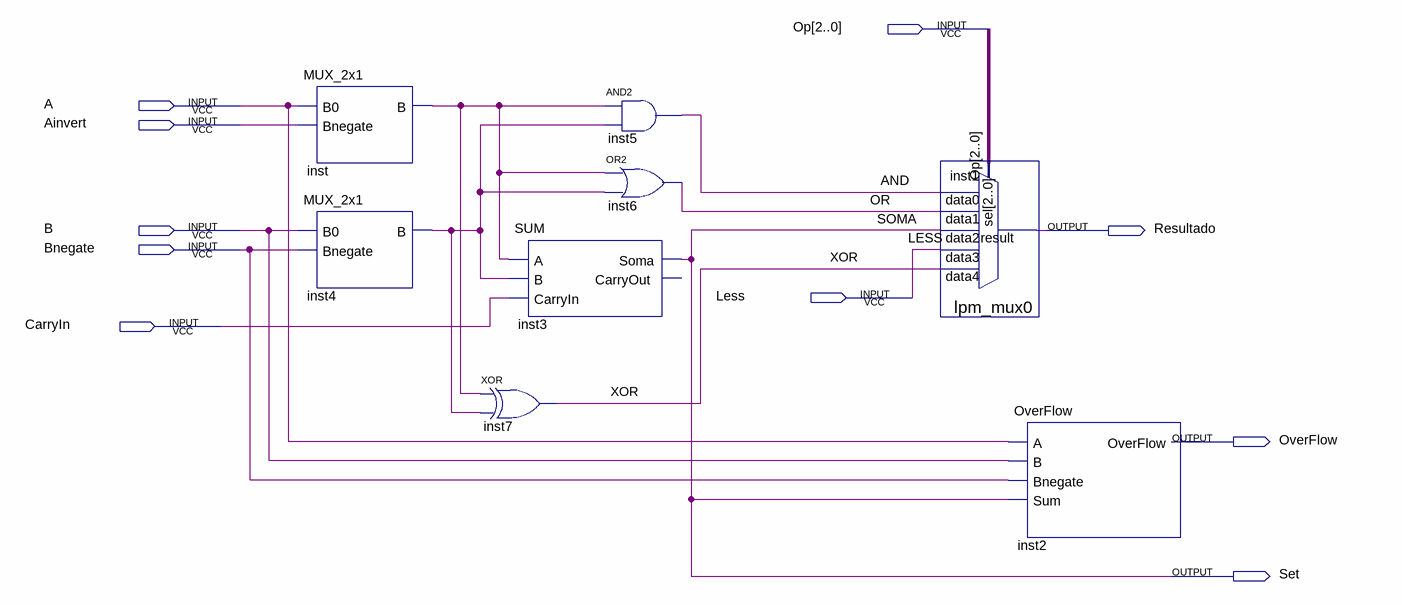
[diagram p0: schematic sheet]
// Quartus schematic MSBALU.bdf as structural Verilog: 8 symbols, 10 pins
module MSBALU (
  input  [2:0] Op,
  input  A,
  input  Ainvert,
  input  B,
  input  Bnegate,
  input  Less,
  input  CarryIn,
  output Resultado,
  output OverFlow,
  output Set
);

  wire AND, inst4_b, inst_b, OR, XOR;

  MUX_2x1 inst (.B0(A), .Bnegate(Ainvert), .B(inst_b));
  MUX_2x1 inst4 (.B0(B), .Bnegate(Bnegate), .B(inst4_b));
  SUM inst3 (.A(inst_b), .B(inst4_b), .CarryIn(CarryIn), .Soma(Set));  // open: CarryOut
  xor inst7 (XOR, inst_b, inst4_b);
  and inst5 (AND, inst_b, inst4_b);
  or inst6 (OR, inst_b, inst4_b);
  lpm_mux0 inst1 (.data4(XOR), .data3(Less), .data2(Set), .data1(OR), .data0(AND), .sel(Op), .result(Resultado));
  OverFlow inst2 (.A(A), .B(B), .Bnegate(Bnegate), .Sum(Set), .OverFlow(OverFlow));

  // Other names for the same wires on the sheet: SOMA = Set
endmodule
